# EAGLE schematic MB_NRF24L01 (EAGLE 6.4)
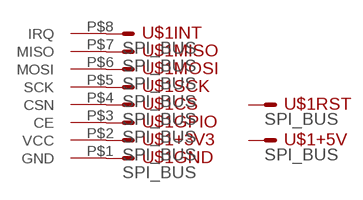
[diagram p0: schematic, sheet 1]

## Parts
U$1  SPI_BUS  [SPI_BUS]
U$2  RF24L01MODULE  [ML8]

## Nets
N$1: U$1.GND U$2.P$1(GND)
N$2: U$1.+3V3 U$2.P$2(VCC)
N$3: U$1.MOSI U$2.P$6(MOSI)
N$4: U$1.MISO U$2.P$7(MISO)
N$5: U$1.SCK U$2.P$5(SCK)
N$6: U$1.CS U$2.P$4(CSN)
N$7: U$1.INT U$2.P$8(IRQ)
N$8: U$1.GPIO U$2.P$3(CE)
Unconnected: U$1.+5V U$1.RST

## Library data of the parts
U$1 = lieven:SPI_BUS
U$2 = lieven:RF24L01